# Altium schematic sheet DDS_RIKEN_main.SchDoc
size 508 x 406 mm
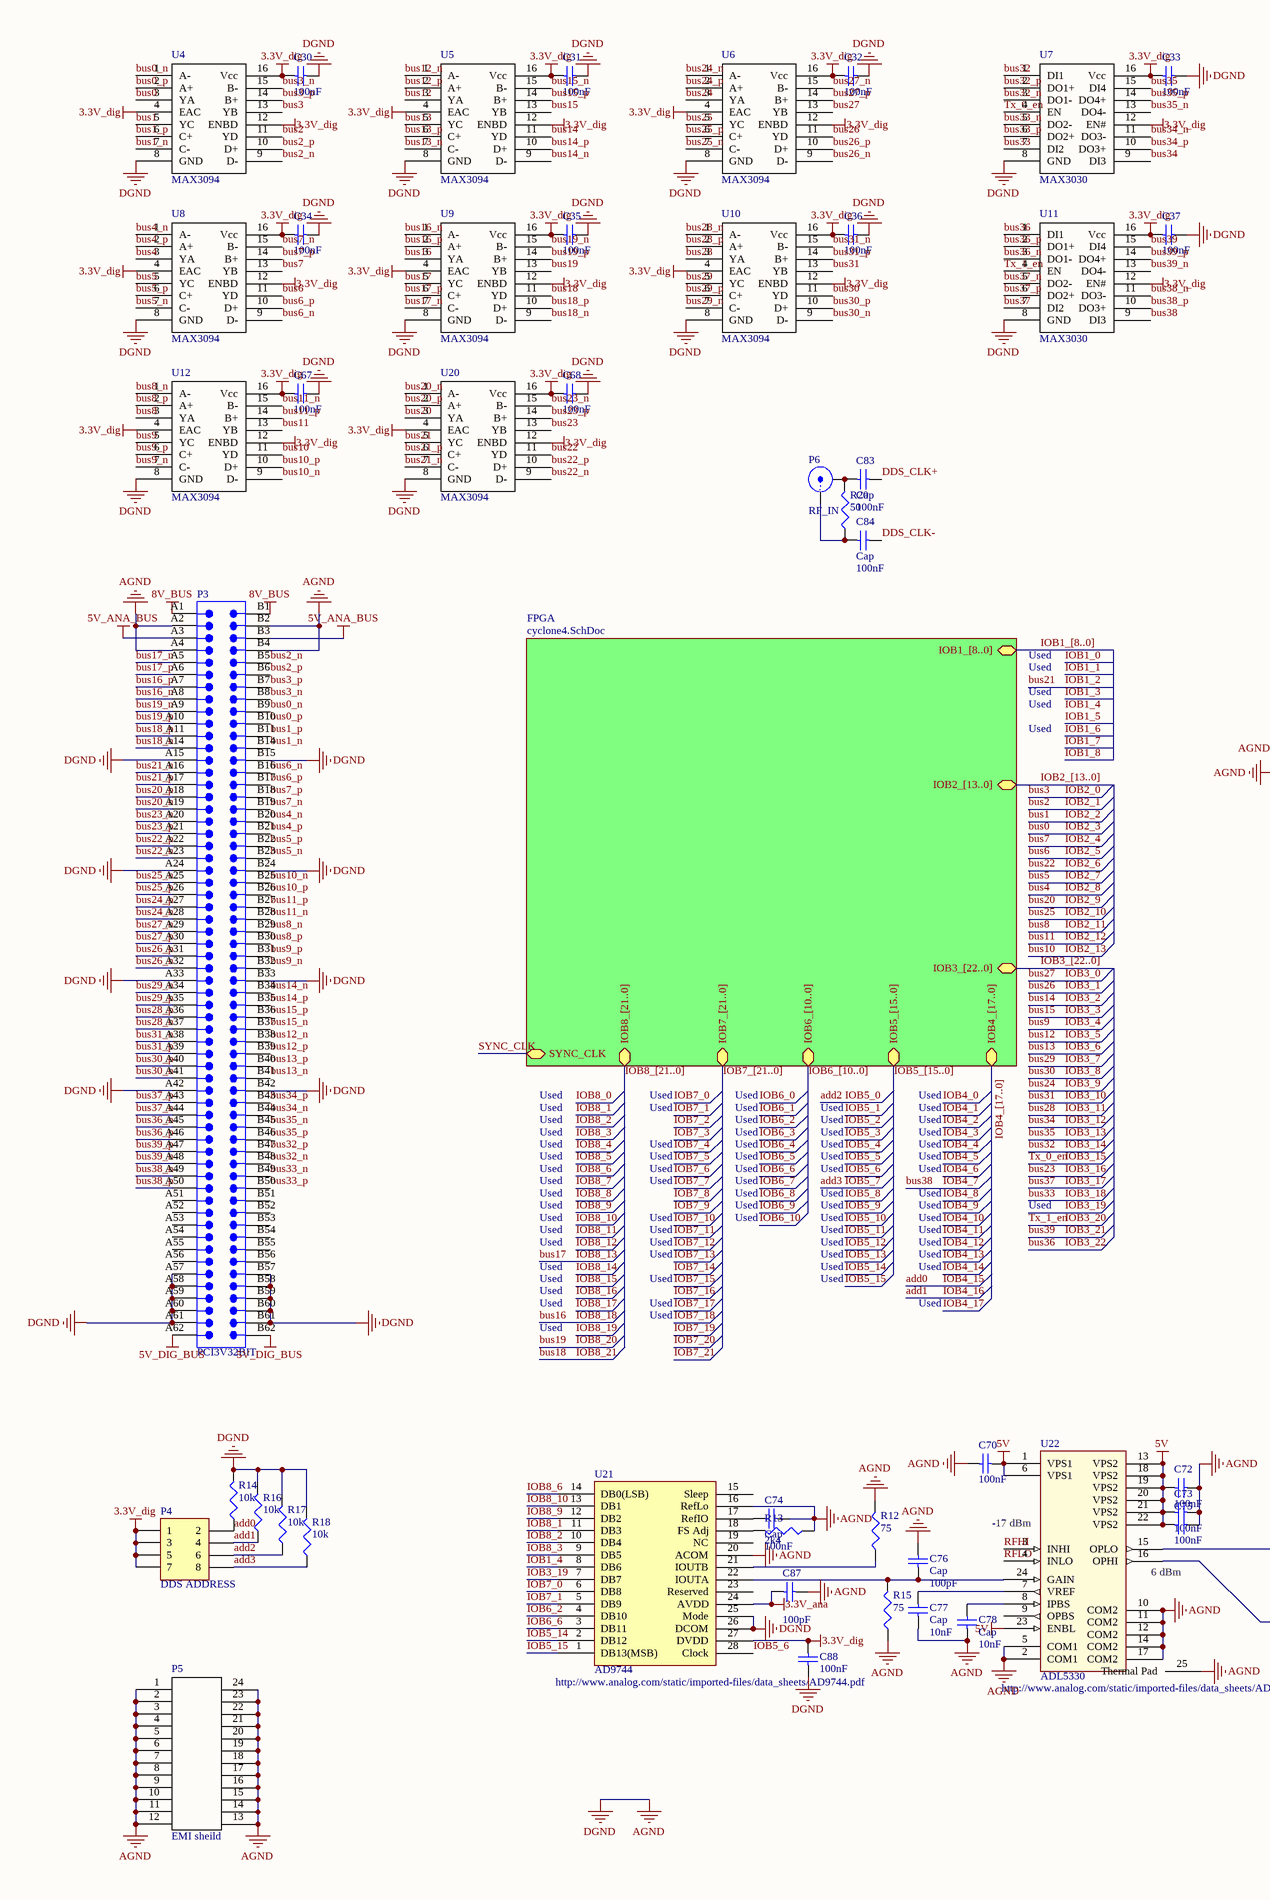
[diagram p0: DDS_RIKEN_main.SchDoc, left]
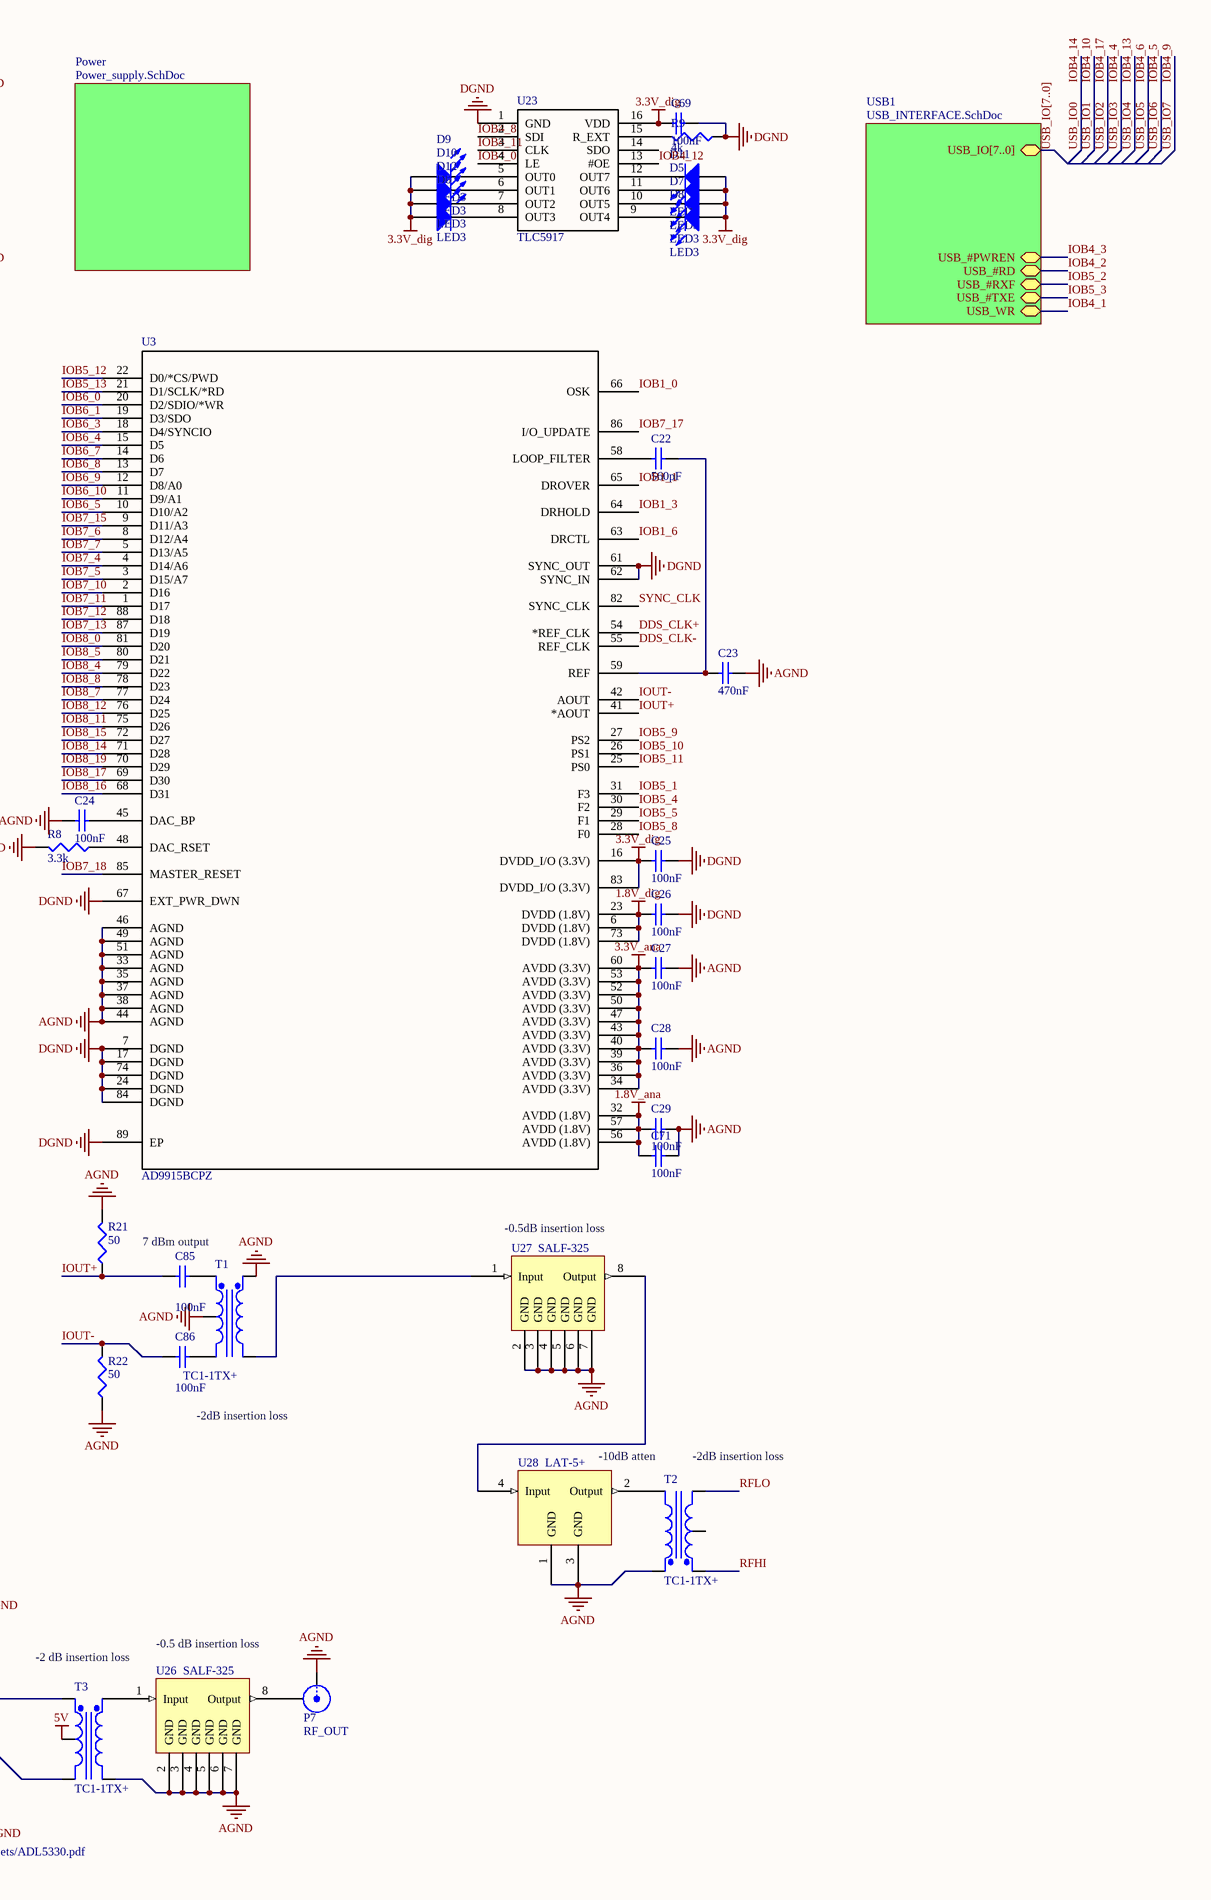
[diagram p1: DDS_RIKEN_main.SchDoc, right]

## Parts
C22  value 560pF  [CAPC2012L]  (hidden comment: Cap Semi)
C23  value 470nF  [CAPC2012L]  (hidden comment: Cap Semi)
C24  value 100nF  [CAPC2012L]  (hidden comment: Cap Semi)
C25  value 100nF  [CAPC2012L]  (hidden comment: Cap Semi)
C26  value 100nF  [CAPC2012L]  (hidden comment: Cap Semi)
C27  value 100nF  [CAPC2012L]  (hidden comment: Cap Semi)
C28  value 100nF  [CAPC2012L]  (hidden comment: Cap Semi)
C29  value 100nF  [CAPC2012L]  (hidden comment: Cap Semi)
C30  value 100nF  [CAPC2012L]  (hidden comment: Cap Semi)
C31  value 100nF  [CAPC2012L]  (hidden comment: Cap Semi)
C32  value 100nF  [CAPC2012L]  (hidden comment: Cap Semi)
C33  value 100nF  [CAPC2012L]  (hidden comment: Cap Semi)
C34  value 100nF  [CAPC2012L]  (hidden comment: Cap Semi)
C35  value 100nF  [CAPC2012L]  (hidden comment: Cap Semi)
C36  value 100nF  [CAPC2012L]  (hidden comment: Cap Semi)
C37  value 100nF  [CAPC2012L]  (hidden comment: Cap Semi)
C67  value 100nF  [CAPC2012L]  (hidden comment: Cap Semi)
C68  value 100nF  [CAPC2012L]  (hidden comment: Cap Semi)
C69  value 100nF  [CAPC2012L]  (hidden comment: Cap Semi)
C70  value 100nF  [CAPC2012L]  (hidden comment: Cap Semi)
C71  value 100nF  [CAPC2012L]  (hidden comment: Cap Semi)
C72  value 100nF  [CAPC2012L]  (hidden comment: Cap Semi)
C73  value 100nF  [CAPC2012L]  (hidden comment: Cap Semi)
C74  Cap  value 100nF  [c0805]
C75  value 100nF  [CAPC2012L]  (hidden comment: Cap Semi)
C76  Cap  value 100pF  [c0805]
C77  Cap  value 10nF  [c0805]
C78  Cap  value 10nF  [c0805]
C83  Cap  value 100nF  [c0805]
C84  Cap  value 100nF  [c0805]
C85  value 100nF  [c0805]  (hidden comment: Cap)
C86  value 100nF  [c0805]  (hidden comment: Cap)
C87  value 100pF  [c0805]  (hidden comment: Cap)
C88  value 100nF  [c0805]  (hidden comment: Cap)
D5  LED3  [DSO-C2/D5.6]
D6  LED3  [DSO-C2/D5.6]
D7  LED3  [DSO-C2/D5.6]
D8  LED3  [DSO-C2/D5.6]
D9  LED3  [DSO-C2/D5.6]
D10  LED3  [DSO-C2/D5.6]
D11  LED3  [DSO-C2/D5.6]
D12  LED3  [DSO-C2/D5.6]
P3  PCI3V32BIT  [PCI3V32BIT]
P4  DDS ADDRESS  [HDR2X4]
P5  EMI sheild  [BMIS-207]
P6  RF_IN  [SMA_Edgecon_31milthick]
P7  RF_OUT  [SMA_Edgecon_31milthick]
R8  value 3.3k  [RESC3216L]
R9  value 4k  [RESC3216L]
R12  value 75  [RESC3216L]
R13  value 2k4  [RESC3216L]
R14  value 10k  [RESC3216L]
R15  value 75  [RESC3216L]
R16  value 10k  [RESC3216L]
R17  value 10k  [RESC3216L]
R18  value 10k  [RESC3216L]
R20  value 50  [RESC3216L]
R21  value 50  [RESC3216L]
R22  value 50  [RESC3216L]
T1  TC1-1TX+  [TC1-1T+]
T2  TC1-1TX+  [TC1-1T+]
T3  TC1-1TX+  [TC1-1T+]
U3  AD9915BCPZ  [CP_88_5]
U4  MAX3094  [TSSOP16]
U5  MAX3094  [TSSOP16]
U6  MAX3094  [TSSOP16]
U7  MAX3030  [TSSOP16]
U8  MAX3094  [TSSOP16]
U9  MAX3094  [TSSOP16]
U10  MAX3094  [TSSOP16]
U11  MAX3030  [TSSOP16]
U12  MAX3094  [TSSOP16]
U20  MAX3094  [TSSOP16]
U21  AD9744  [TSOP65P640-28AM]
U22  ADL5330  [QFN50P400X400-24VAN]
U23  TLC5917  [D016_N]
U26  SALF-325  [SALF-325]
U27  SALF-325  [SALF-325]
U28  LAT-5+  [LAT-10+]

## Sub-sheets
FPGA = cyclone4.SchDoc: IOB1_[8..0], IOB2_[13..0], IOB3_[22..0], IOB4_[17..0], IOB5_[15..0], IOB6_[10..0], IOB7_[21..0], IOB8_[21..0], SYNC_CLK
Power = Power_supply.SchDoc: no entries
USB1 = USB_INTERFACE.SchDoc: USB_IO[7..0], USB_#PWREN, USB_#RD, USB_#RXF, USB_#TXE, USB_WR

## Nets
1.8V_ana: C29.1 C71.1 U3.32(AVDD_(1.8V)) U3.56(AVDD_(1.8V)) U3.57(AVDD_(1.8V))
1.8V_dig: C26.1 U3.6(DVDD_(1.8V)) U3.23(DVDD_(1.8V)) U3.73(DVDD_(1.8V))
3.3V_ana: C27.1 C28.1 C87.2 U3.34(AVDD_(3.3V)) U3.36(AVDD_(3.3V)) U3.39(AVDD_(3.3V)) U3.40(AVDD_(3.3V)) U3.43(AVDD_(3.3V)) U3.47(AVDD_(3.3V)) U3.50(AVDD_(3.3V)) U3.52(AVDD_(3.3V)) U3.53(AVDD_(3.3V)) U3.60(AVDD_(3.3V)) U21.24(AVDD)
3.3V_dig: C25.1 C30.1 C31.1 C32.1 C33.1 C34.1 C35.1 C36.1 C37.1 C67.1 C68.1 C69.1 C88.1 D5.1(A) D6.1(A) D7.1(A) D8.1(A) D9.1(A) D10.1(A) D11.1(A) D12.1(A) P4.1 P4.3 P4.5 P4.7 U3.16(DVDD_I/O_(3.3V)) U3.83(DVDD_I/O_(3.3V)) U4.4(EAC) U4.12(ENBD) U4.16(Vcc) U5.4(EAC) U5.12(ENBD) U5.16(Vcc) U6.4(EAC) U6.12(ENBD) U6.16(Vcc) U7.12(EN#) U7.16(Vcc) U8.4(EAC) U8.12(ENBD) U8.16(Vcc) U9.4(EAC) U9.12(ENBD) U9.16(Vcc) U10.4(EAC) U10.12(ENBD) U10.16(Vcc) U11.12(EN#) U11.16(Vcc) U12.4(EAC) U12.12(ENBD) U12.16(Vcc) U20.4(EAC) U20.12(ENBD) U20.16(Vcc) U21.27(DVDD) U23.16(VDD)
5V: C70.2 C72.1 C73.1 C75.1 T3.2(SecCT) U22.1(VPS1) U22.6(VPS1) U22.13(VPS2) U22.18(VPS2) U22.19(VPS2) U22.20(VPS2) U22.21(VPS2) U22.22(VPS2) U22.23(ENBL)
5V_ANA_BUS: P3.A3 P3.B3
5V_DIG_BUS: P3.A62 P3.B62
8V_BUS: P3.A1 P3.B1
AGND: C23.2 C24.1 C25.2 C26.2 C27.2 C28.2 C29.2 C30.2 C31.2 C32.2 C33.2 C34.2 C35.2 C36.2 C37.2 C67.2 C68.2 C69.2 C70.1 C71.2 C72.2 C73.2 C74.1 C75.2 C76.2 C77.1 C78.1 C87.1 C88.2 P3.A2 P3.A4 P3.A15 P3.A24 P3.A33 P3.A42 P3.A57 P3.A58 P3.A59 P3.A60 P3.A61 P3.B2 P3.B4 P3.B15 P3.B24 P3.B33 P3.B42 P3.B57 P3.B58 P3.B59 P3.B60 P3.B61 P5.1 P5.2(A10) P5.3(A11) P5.4(A12) P5.5(A13) P5.6(A14) P5.7(A15) P5.8(A16) P5.9(A17) P5.10(A18) P5.11(A26) P5.12(A25) P5.13(A23) P5.14(A24) P5.15(A22) P5.16(A19) P5.17(A20) P5.18(A21) P5.19(A8) P5.20(A7) P5.21(A6) P5.22(A5) P5.23(A4) P5.24(A3) P7.1(X) R8.2 R9.1 R12.2 R13.1 R14.2 R15.1 R16.2 R17.2 R18.2 R21.2 R22.1 T1.2(SecCT) T1.6(Pri+) T2.6(Pri+) T3.4(Pri-) U3.7(DGND) U3.17(DGND) U3.24(DGND) U3.33(AGND) U3.35(AGND) U3.37(AGND) U3.38(AGND) U3.44(AGND) U3.46(AGND) U3.49(AGND) U3.51(AGND) U3.61(SYNC_OUT) U3.62(SYNC_IN) U3.67(EXT_PWR_DWN) U3.74(DGND) U3.84(DGND) U3.89(EP) U4.8(GND) U5.8(GND) U6.8(GND) U7.8(GND) U8.8(GND) U9.8(GND) U10.8(GND) U11.8(GND) U12.8(GND) U20.8(GND) U21.16(RefLo) U21.20(ACOM) U21.25(Mode) U21.26(DCOM) U22.2(COM1) U22.5(COM1) U22.10(COM2) U22.11(COM2) U22.12(COM2) U22.14(COM2) U22.17(COM2) U22.25(Thermal_Pad) U23.1(GND) U26.2(GND) U26.3(GND) U26.4(GND) U26.5(GND) U26.6(GND) U26.7(GND) U27.2(GND) U27.3(GND) U27.4(GND) U27.5(GND) U27.6(GND) U27.7(GND) U28.1(GND) U28.3(GND)  [also labelled DGND]
add0: P4.2 R14.1  [also labelled IOB4_15]
add1: P4.4 R16.1  [also labelled IOB4_16]
add2: P4.6 R17.1  [also labelled IOB5_0]
add3: P4.8 R18.1  [also labelled IOB5_7]
bus0: U4.3(YA)  [also labelled IOB2_3]
bus0_n: P3.B9 U4.1(A-)
bus0_p: P3.B10 U4.2(A+)
bus1: U4.5(YC)  [also labelled IOB2_2]
bus1_n: P3.B14 U4.7(C-)
bus1_p: P3.B11 U4.6(C+)
bus2: U4.11(YD)  [also labelled IOB2_1]
bus2_n: P3.B5 U4.9(D-)
bus2_p: P3.B6 U4.10(D+)
bus3: U4.13(YB)  [also labelled IOB2_0]
bus3_n: P3.B8 U4.15(B-)
bus3_p: P3.B7 U4.14(B+)
bus4: U8.3(YA)  [also labelled IOB2_8]
bus4_n: P3.B20 U8.1(A-)
bus4_p: P3.B21 U8.2(A+)
bus5: U8.5(YC)  [also labelled IOB2_7]
bus5_n: P3.B23 U8.7(C-)
bus5_p: P3.B22 U8.6(C+)
bus6: U8.11(YD)  [also labelled IOB2_5]
bus6_n: P3.B16 U8.9(D-)
bus6_p: P3.B17 U8.10(D+)
bus7: U8.13(YB)  [also labelled IOB2_4]
bus7_n: P3.B19 U8.15(B-)
bus7_p: P3.B18 U8.14(B+)
bus8: U12.3(YA)  [also labelled IOB2_11]
bus8_n: P3.B29 U12.1(A-)
bus8_p: P3.B30 U12.2(A+)
bus9: U12.5(YC)  [also labelled IOB3_4]
bus9_n: P3.B32 U12.7(C-)
bus9_p: P3.B31 U12.6(C+)
bus10: U12.11(YD)  [also labelled IOB2_13]
bus10_n: P3.B25 U12.9(D-)
bus10_p: P3.B26 U12.10(D+)
bus11: U12.13(YB)  [also labelled IOB2_12]
bus11_n: P3.B28 U12.15(B-)
bus11_p: P3.B27 U12.14(B+)
bus12: U5.3(YA)  [also labelled IOB3_5]
bus12_n: P3.B38 U5.1(A-)
bus12_p: P3.B39 U5.2(A+)
bus13: U5.5(YC)  [also labelled IOB3_6]
bus13_n: P3.B41 U5.7(C-)
bus13_p: P3.B40 U5.6(C+)
bus14: U5.11(YD)  [also labelled IOB3_2]
bus14_n: P3.B34 U5.9(D-)
bus14_p: P3.B35 U5.10(D+)
bus15: U5.13(YB)  [also labelled IOB3_3]
bus15_n: P3.B37 U5.15(B-)
bus15_p: P3.B36 U5.14(B+)
bus16: U9.3(YA)  [also labelled IOB8_18]
bus16_n: P3.A8 U9.1(A-)
bus16_p: P3.A7 U9.2(A+)
bus17: U9.5(YC)  [also labelled IOB8_13]
bus17_n: P3.A5 U9.7(C-)
bus17_p: P3.A6 U9.6(C+)
bus18: U9.11(YD)  [also labelled IOB8_21]
bus18_n: P3.A14 U9.9(D-)
bus18_p: P3.A11 U9.10(D+)
bus19: U9.13(YB)  [also labelled IOB8_20]
bus19_n: P3.A9 U9.15(B-)
bus19_p: P3.A10 U9.14(B+)
bus20: U20.3(YA)  [also labelled IOB2_9]
bus20_n: P3.A19 U20.1(A-)
bus20_p: P3.A18 U20.2(A+)
bus21: U20.5(YC)  [also labelled IOB1_2]
bus21_n: P3.A16 U20.7(C-)
bus21_p: P3.A17 U20.6(C+)
bus22: U20.11(YD)  [also labelled IOB2_6]
bus22_n: P3.A23 U20.9(D-)
bus22_p: P3.A22 U20.10(D+)
bus23: U20.13(YB)  [also labelled IOB3_16]
bus23_n: P3.A20 U20.15(B-)
bus23_p: P3.A21 U20.14(B+)
bus24: U6.3(YA)  [also labelled IOB3_9]
bus24_n: P3.A28 U6.1(A-)
bus24_p: P3.A27 U6.2(A+)
bus25: U6.5(YC)  [also labelled IOB2_10]
bus25_n: P3.A25 U6.7(C-)
bus25_p: P3.A26 U6.6(C+)
bus26: U6.11(YD)  [also labelled IOB3_1]
bus26_n: P3.A32 U6.9(D-)
bus26_p: P3.A31 U6.10(D+)
bus27: U6.13(YB)  [also labelled IOB3_0]
bus27_n: P3.A29 U6.15(B-)
bus27_p: P3.A30 U6.14(B+)
bus28: U10.3(YA)  [also labelled IOB3_11]
bus28_n: P3.A37 U10.1(A-)
bus28_p: P3.A36 U10.2(A+)
bus29: U10.5(YC)  [also labelled IOB3_7]
bus29_n: P3.A34 U10.7(C-)
bus29_p: P3.A35 U10.6(C+)
bus30: U10.11(YD)  [also labelled IOB3_8]
bus30_n: P3.A41 U10.9(D-)
bus30_p: P3.A40 U10.10(D+)
bus31: U10.13(YB)  [also labelled IOB3_10]
bus31_n: P3.A38 U10.15(B-)
bus31_p: P3.A39 U10.14(B+)
bus32: U7.1(DI1)  [also labelled IOB3_14]
bus32_n: P3.B48 U7.3(DO1-)
bus32_p: P3.B47 U7.2(DO1+)
bus33: U7.7(DI2)  [also labelled IOB3_18]
bus33_n: P3.B49 U7.5(DO2-)
bus33_p: P3.B50 U7.6(DO2+)
bus34: U7.9(DI3)  [also labelled IOB3_12]
bus34_n: P3.B44 U7.11(DO3-)
bus34_p: P3.B43 U7.10(DO3+)
bus35: U7.15(DI4)  [also labelled IOB3_13]
bus35_n: P3.B45 U7.13(DO4-)
bus35_p: P3.B46 U7.14(DO4+)
bus36: U11.1(DI1)  [also labelled IOB3_22]
bus36_n: P3.A45 U11.3(DO1-)
bus36_p: P3.A46 U11.2(DO1+)
bus37: U11.7(DI2)  [also labelled IOB3_17]
bus37_n: P3.A44 U11.5(DO2-)
bus37_p: P3.A43 U11.6(DO2+)
bus38: U11.9(DI3)  [also labelled IOB4_7]
bus38_n: P3.A49 U11.11(DO3-)
bus38_p: P3.A50 U11.10(DO3+)
bus39: U11.15(DI4)  [also labelled IOB3_21]
bus39_n: P3.A48 U11.13(DO4-)
bus39_p: P3.A47 U11.14(DO4+)
DDS_CLK+: C83.1 U3.54(*REF_CLK)
DDS_CLK-: C84.1 U3.55(REF_CLK)
IOB1_0: U3.66(OSK)
IOB1_1: U3.65(DROVER)
IOB1_3: U3.64(DRHOLD)
IOB1_4: U21.8(DB6)
IOB1_6: U3.63(DRCTL)
IOB3_15: U7.4(EN)  [also labelled Tx_0_en]
IOB3_19: U21.7(DB7)
IOB3_20: U11.4(EN)  [also labelled Tx_1_en]
IOB4_0: U23.4(LE)
IOB4_1: sheet USB1/USB_WR
IOB4_2: sheet USB1/USB_#RD
IOB4_3: sheet USB1/USB_#PWREN
IOB4_8: U23.2(SDI)
IOB4_11: U23.3(CLK)
IOB4_12: U23.13(#OE)
IOB5_1: U3.31(F3)
IOB5_2: sheet USB1/USB_#RXF
IOB5_3: sheet USB1/USB_#TXE
IOB5_4: U3.30(F2)
IOB5_5: U3.29(F1)
IOB5_6: U21.28(Clock)
IOB5_8: U3.28(F0)
IOB5_9: U3.27(PS2)
IOB5_10: U3.26(PS1)
IOB5_11: U3.25(PS0)
IOB5_12: U3.22(D0/*CS/PWD)
IOB5_13: U3.21(D1/SCLK/*RD)
IOB5_14: U21.2(DB12)
IOB5_15: U21.1(DB13(MSB))
IOB6_0: U3.20(D2/SDIO/*WR)
IOB6_1: U3.19(D3/SDO)
IOB6_2: U21.4(DB10)
IOB6_3: U3.18(D4/SYNCIO)
IOB6_4: U3.15(D5)
IOB6_5: U3.10(D10/A2)
IOB6_6: U21.3(DB11)
IOB6_7: U3.14(D6)
IOB6_8: U3.13(D7)
IOB6_9: U3.12(D8/A0)
IOB6_10: U3.11(D9/A1)
IOB7_0: U21.6(DB8)
IOB7_1: U21.5(DB9)
IOB7_4: U3.4(D14/A6)
IOB7_5: U3.3(D15/A7)
IOB7_6: U3.8(D12/A4)
IOB7_7: U3.5(D13/A5)
IOB7_10: U3.2(D16)
IOB7_11: U3.1(D17)
IOB7_12: U3.88(D18)
IOB7_13: U3.87(D19)
IOB7_15: U3.9(D11/A3)
IOB7_17: U3.86(I/O_UPDATE)
IOB7_18: U3.85(MASTER_RESET)
IOB8_0: U3.81(D20)
IOB8_1: U21.11(DB3)
IOB8_2: U21.10(DB4)
IOB8_3: U21.9(DB5)
IOB8_4: U3.79(D22)
IOB8_5: U3.80(D21)
IOB8_6: U21.14(DB0(LSB))
IOB8_7: U3.77(D24)
IOB8_8: U3.78(D23)
IOB8_9: U21.12(DB2)
IOB8_10: U21.13(DB1)
IOB8_11: U3.75(D26)
IOB8_12: U3.76(D25)
IOB8_14: U3.71(D28)
IOB8_15: U3.72(D27)
IOB8_16: U3.68(D31)
IOB8_17: U3.69(D30)
IOB8_19: U3.70(D29)
IOUT+: C85.2 R21.1 U3.41(*AOUT)
IOUT-: C86.2 R22.2 U3.42(AOUT)
RFHI: T2.3(Sec+) U22.3(INHI)
RFLO: T2.1(Sec-) U22.4(INLO)
SYNC_CLK: U3.82(SYNC_CLK) ; sheet FPGA/SYNC_CLK
NetC22_1: C22.1 U3.58(LOOP_FILTER)
NetC22_2: C22.2 C23.1 U3.59(REF)
NetC24_2: C24.2 U3.45(DAC_BP)
NetC74_2: C74.2 U21.17(RefIO)
NetC76_1: C76.1 R15.2 U21.22(IOUTA) U22.24(GAIN)
NetC77_2: C77.2 U22.7(VREF)
NetC78_2: C78.2 U22.8(IPBS)
NetC83_2: C83.2 P6.2(Y) R20.2
NetC84_2: C84.2 P6.1(X) R20.1
NetC85_1: C85.1 T1.3(Sec+)
NetC86_1: C86.1 T1.1(Sec-)
NetD5_2: D5.2(K) U23.11(OUT6)
NetD6_2: D6.2(K) U23.8(OUT3)
NetD7_2: D7.2(K) U23.10(OUT5)
NetD8_2: D8.2(K) U23.9(OUT4)
NetD9_2: D9.2(K) U23.5(OUT0)
NetD10_2: D10.2(K) U23.6(OUT1)
NetD11_2: D11.2(K) U23.12(OUT7)
NetD12_2: D12.2(K) U23.7(OUT2)
NetP7_2: P7.2(Y) U26.8(Output)
NetR8_1: R8.1 U3.48(DAC_RSET)
NetR9_2: R9.2 U23.15(R_EXT)
NetR12_1: R12.1 U21.21(IOUTB)
NetR13_2: R13.2 U21.18(FS_Adj)
NetT1_4: T1.4(Pri-) U27.1(Input)
NetT2_4: T2.4(Pri-) U28.2(Output)
NetT3_1: T3.1(Sec-) U22.16(OPHI)
NetT3_3: T3.3(Sec+) U22.15(OPLO)
NetT3_6: T3.6(Pri+) U26.1(Input)
NetU27_8: U27.8(Output) U28.4(Input)

Not connected (* = marked no-connect by the designer): P3 A51 A52 A53 A54 A55 A56 B51 B52 B53 B54 B55 B56; T2 2(SecCT); U21 15(Sleep) 19(NC) 23(Reserved); U22 9(OPBS); U23 14(SDO)

## Buses and harness runs
bus IOB1_[8..0] = sheet FPGA/IOB1_[8..0]
bus IOB2_[13..0] = sheet FPGA/IOB2_[13..0]
bus IOB3_[22..0] = sheet FPGA/IOB3_[22..0]
bus IOB4_[17..0] = sheet FPGA/IOB4_[17..0]
bus IOB5_[15..0] = sheet FPGA/IOB5_[15..0]
bus IOB6_[10..0] = sheet FPGA/IOB6_[10..0]
bus IOB7_[21..0] = sheet FPGA/IOB7_[21..0]
bus IOB8_[21..0] = sheet FPGA/IOB8_[21..0]
bus USB_IO[7..0] = sheet USB1/USB_IO[7..0]

## Notes on the sheet
- Used
- (near U27) -0.5dB insertion loss
- 7 dBm output
- -2dB insertion loss
- -10dB atten
- (near T2) -2dB insertion loss
- (near U22) -17 dBm
- -2 dB insertion loss
- -0.5 dB insertion loss
- (near U22) 6 dBm
- Labels drawn without touching a wire or pin: IOB1_4

## Library data of the parts
C22-C37 C67-C73 C75 = Cap Semi: Capacitor (Semiconductor SIM Model); Published: 8-Jun-2000; LatestRevisionDate: 29-May-2009; LatestRevisionNote: IPC-7351 Footprint Added.; PackageReference: C1206; Publisher: Altium Limited; PackageDescription: Chip Capacitor
C74 C76-C78 C83-C88 = Cap: Capacitor; Voltage: 16V; Published: 8-Jun-2000; LatestRevisionDate: 17-Jul-2002; LatestRevisionNote: Re-released for DXP Platform.; PackageReference: RAD-0.3; Publisher: Altium Limited
D5-D12 = LED3: Typical BLUE SiC LED; Published: 8-Jun-2000; LatestRevisionDate: 17-Dec-2003; LatestRevisionNote: PCB Footprint replaced.; DatasheetVersion: 16-Apr-2002; PackageVersion: 16-Apr-2002; PackageReference: 3.5X2.8X1.9; Publisher: Altium Limited
P3 = PCI3V32BIT: Card, 120-Position; Text Field6: Pins A12, A13, B12 & B13 are not present.  Alternate Layout Available; Text Field7: Published 14-Feb-2002
P4 = Header 4X2: Header, 4-Pin, Dual row; LatestRevisionDate: 17-Jul-2002; LatestRevisionNote: Re-released for DXP Platform.; Publisher: Altium Limited
P5 = BMIS-207: Laird Shield; LatestRevisionDate: 17-Jul-2002; LatestRevisionNote: Re-released for DXP Platform.; Publisher: Altium Limited
P6 P7 = SMB: SMA Straight Connector; pin to pad: 1>2 2>1; LatestRevisionDate: 17-Jul-2002; LatestRevisionNote: Re-released for DXP Platform.; Publisher: Altium Limited
R8 R9 R12-R18 R20-R22 = Res3: Resistor; Published: 8-Jun-2000; LatestRevisionDate: 29-May-2009; LatestRevisionNote: IPC-7351 Footprint Added.; PackageReference: J1-0603; Publisher: Altium Limited; PackageDescription: Chip Resistor
T1-T3 = Trans CT: Center-Tapped Transformer (Coupled Inductor Model); Published: 8-Jun-2000; LatestRevisionDate: 17-Jul-2002; LatestRevisionNote: Re-released for DXP Platform.; PackageReference: TRF_5; Publisher: Altium Limited
U3 = AD9915BCPZ: Imported; RefDes: RefDes; Type: DEV; Value: Value
U4-U6 U8-U10 U12 U20 = MAX3094: Differential Line Receivers
U7 U11 = MAX3030: Differential Line Transmitter
U22 = ADL5330: analoger Abschwächer; HelpURL: http://www.analog.com/static/imported-files/data_sheets/ADL5330.pdf
U23 = TLC5917: 8-bit LED driver (Serial)
U28 = LAT-30+
U21 = AD9744: HelpURL: http://www.analog.com/static/imported-files/data_sheets/AD9744.pdf